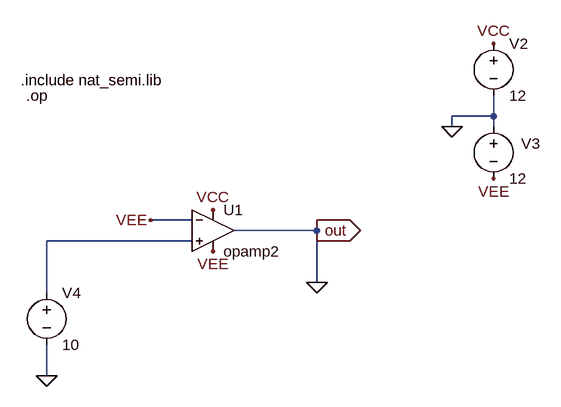
[diagram p0: schematic Experimenting.asc]
Experimenting.asc, the LTspice schematic file:
Version 4.1
SHEET 1 880 680
WIRE 672 -48 672 -80
WIRE 672 -48 608 -48
WIRE 608 -32 608 -48
WIRE 672 -32 672 -48
WIRE 208 112 144 112
WIRE 400 128 400 112
WIRE 400 128 272 128
WIRE 208 144 -16 144
WIRE 400 208 400 128
WIRE -16 224 -16 144
WIRE -16 352 -16 304
FLAG 672 -160 VCC
FLAG 672 48 VEE
FLAG 608 -32 0
FLAG 240 96 VCC
FLAG 240 160 VEE
FLAG -16 352 0
FLAG 144 112 VEE
FLAG 400 128 out
IOPIN 400 128 Out
FLAG 400 208 0
SYMBOL voltage 672 -176 R0
WINDOW 123 0 0 Left 0
WINDOW 39 0 0 Left 0
SYMATTR InstName V2
SYMATTR Value 12
SYMBOL voltage 672 -48 R0
WINDOW 0 43 42 Left 2
SYMATTR InstName V3
SYMATTR Value 12
SYMBOL OpAmps\\opamp2 240 64 R0
SYMATTR InstName U1
SYMBOL voltage -16 208 R0
SYMATTR InstName V4
SYMATTR Value 10
TEXT -48 -80 Left 2 !.op
TEXT -56 -104 Left 2 !.include nat_semi.lib

The netlist it stands for:
* Experimenting.asc
V2 VCC 0 12
V3 0 VEE 12
X§U1 N001 VEE VCC VEE 0 opamp2  ; pins In+ In- V+ V- OUT
V4 N001 0 10
.op
.include nat_semi.lib
.backanno
.end